# EAGLE design ClockBoard (EAGLE 5.12)

## Sheet 1 of 2
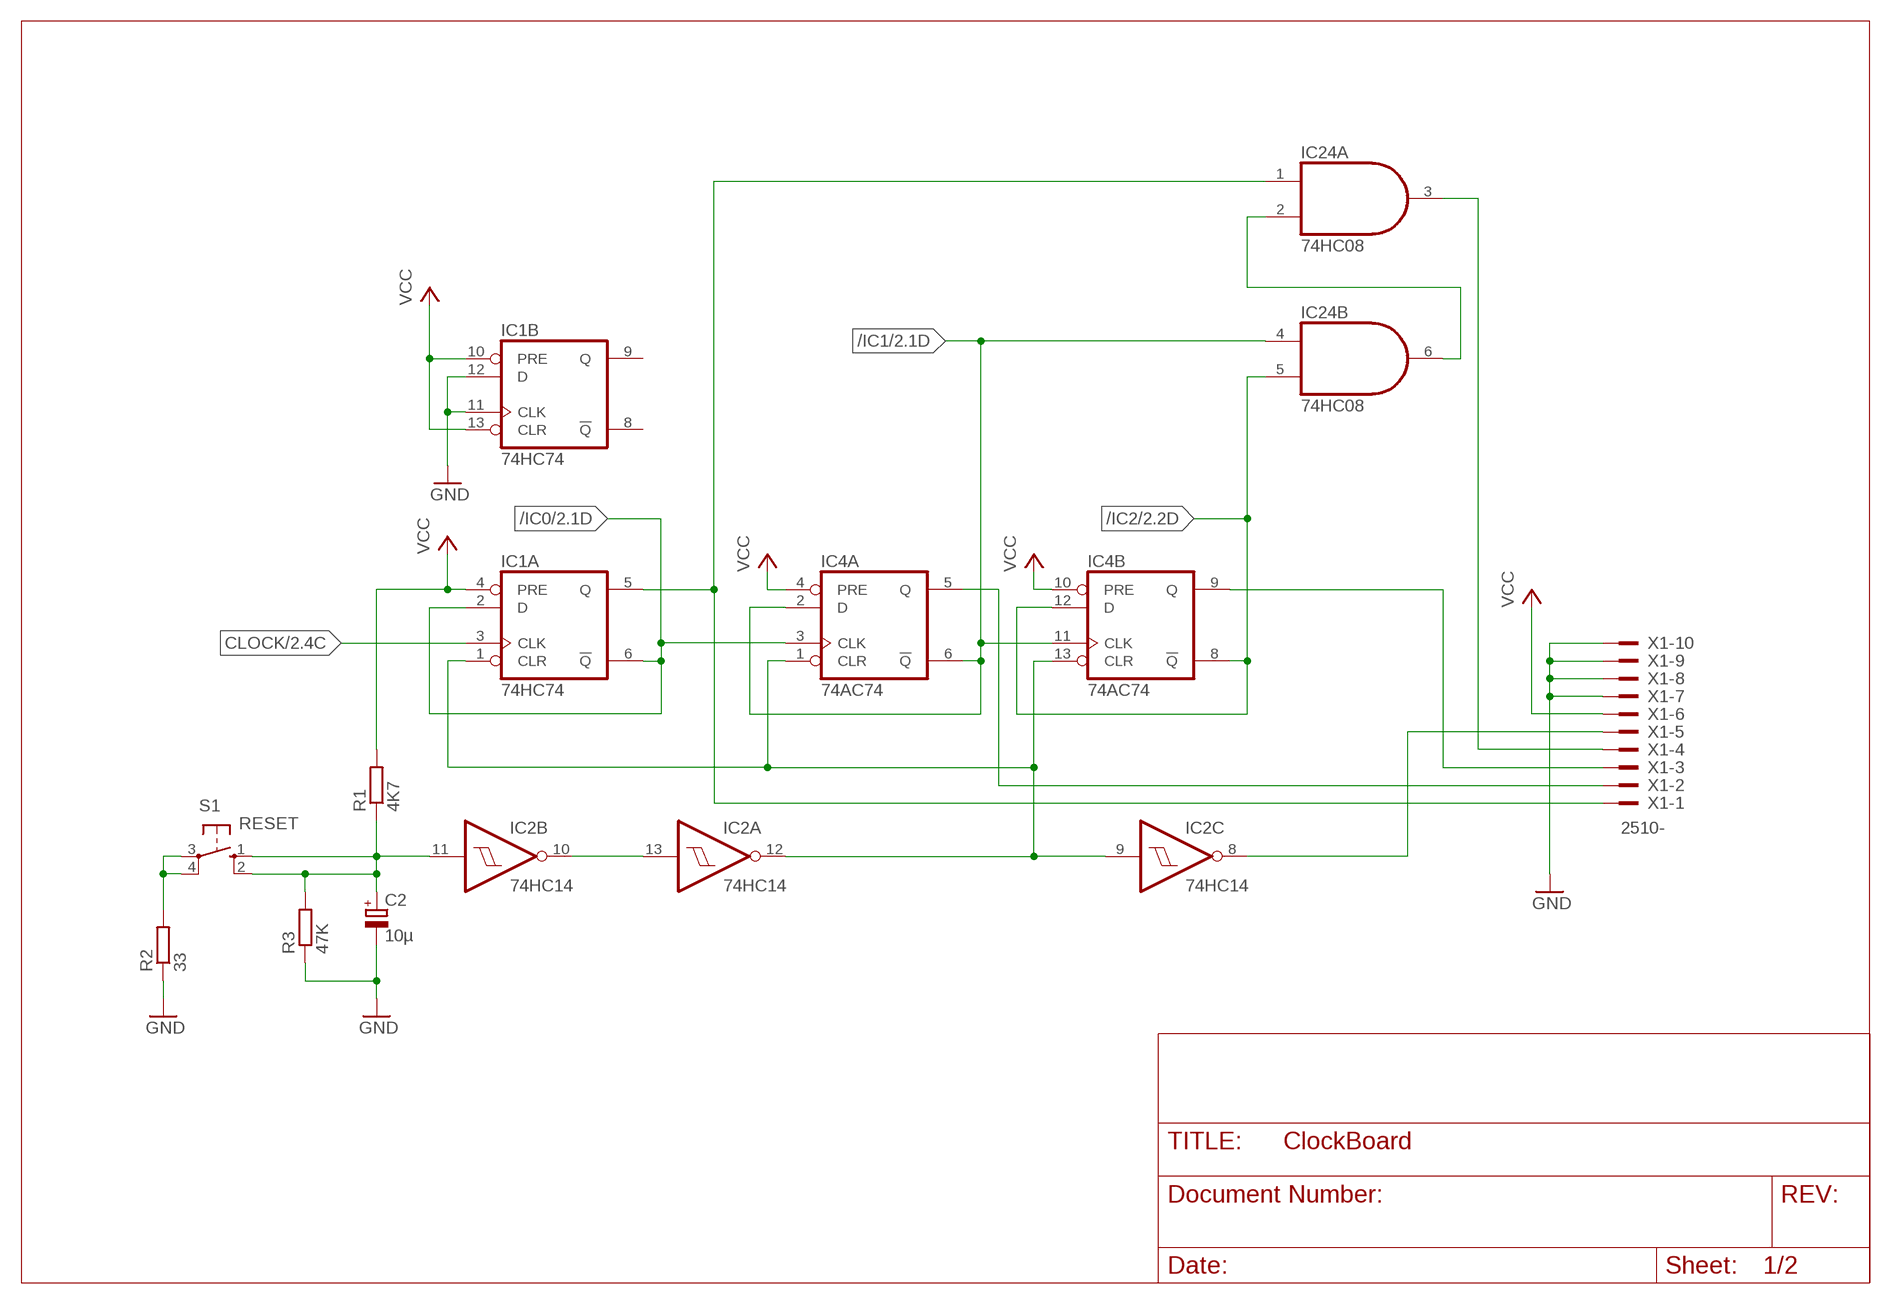
[diagram p0: schematic, sheet 1]

### Parts
C2  10µ  CPOL-EUE2,5-6E  [E2,5-6E]
IC1  74HC74  74LS74N  [DIL14]
IC2  74HC14  74LS14N  [DIL14]
IC4  74AC74  74LS74N  [DIL14]
IC24  74HC08  74LS08N  [DIL14]
R1  4K7  R-EU_0207/10  [0207/10]
R2  33  R-EU_0207/10  [0207/10]
R3  47K  R-EU_0207/10  [0207/10]
S1  RESET  10-XX  [B3F-10XX]
X1  2510-  [PAK100/2500-10]

### Nets
/IC0: IC1.2(A:D) IC1.6(A:!Q) IC4.3(A:CLK) ; also sheet 2
/IC1: IC4.2(A:D) IC4.6(A:!Q) IC4.11(B:CLK) IC24.4(B:I0) ; also sheet 2
/IC2: IC4.8(B:!Q) IC4.12(B:D) IC24.5(B:I1) ; also sheet 2
/RESET: IC1.1(A:CLR) IC2.9(C:I) IC2.12(A:O) IC4.1(A:CLR) IC4.13(B:CLR)
CLOCK: IC1.3(A:CLK) ; also sheet 2
GND: C2.- IC1.11(B:CLK) IC1.12(B:D) R2.1 R3.1 X1.7 X1.8 X1.9 X1.10 ; also sheet 2
IC0: IC1.5(A:Q) IC24.1(A:I0) X1.1
IC1: IC4.5(A:Q) X1.2
IC2: IC4.9(B:Q) X1.3
LOAD_INST: IC24.3(A:O) X1.4
N$3: C2.+ IC2.11(B:I) R1.1 R3.2 S1.1(S) S1.2(S1)
N$4: IC2.10(B:O) IC2.13(A:I)
N$7: R2.2 S1.3(P) S1.4(P1)
N$21: IC24.2(A:I1) IC24.6(B:O)
RESET: IC2.8(C:O) X1.5
VCC: IC1.4(A:PRE) IC1.10(B:PRE) IC1.13(B:CLR) IC4.4(A:PRE) IC4.10(B:PRE) R1.2 X1.6 ; also sheet 2
Unconnected: IC1.8(B:!Q) IC1.9(B:Q)

## Sheet 2 of 2
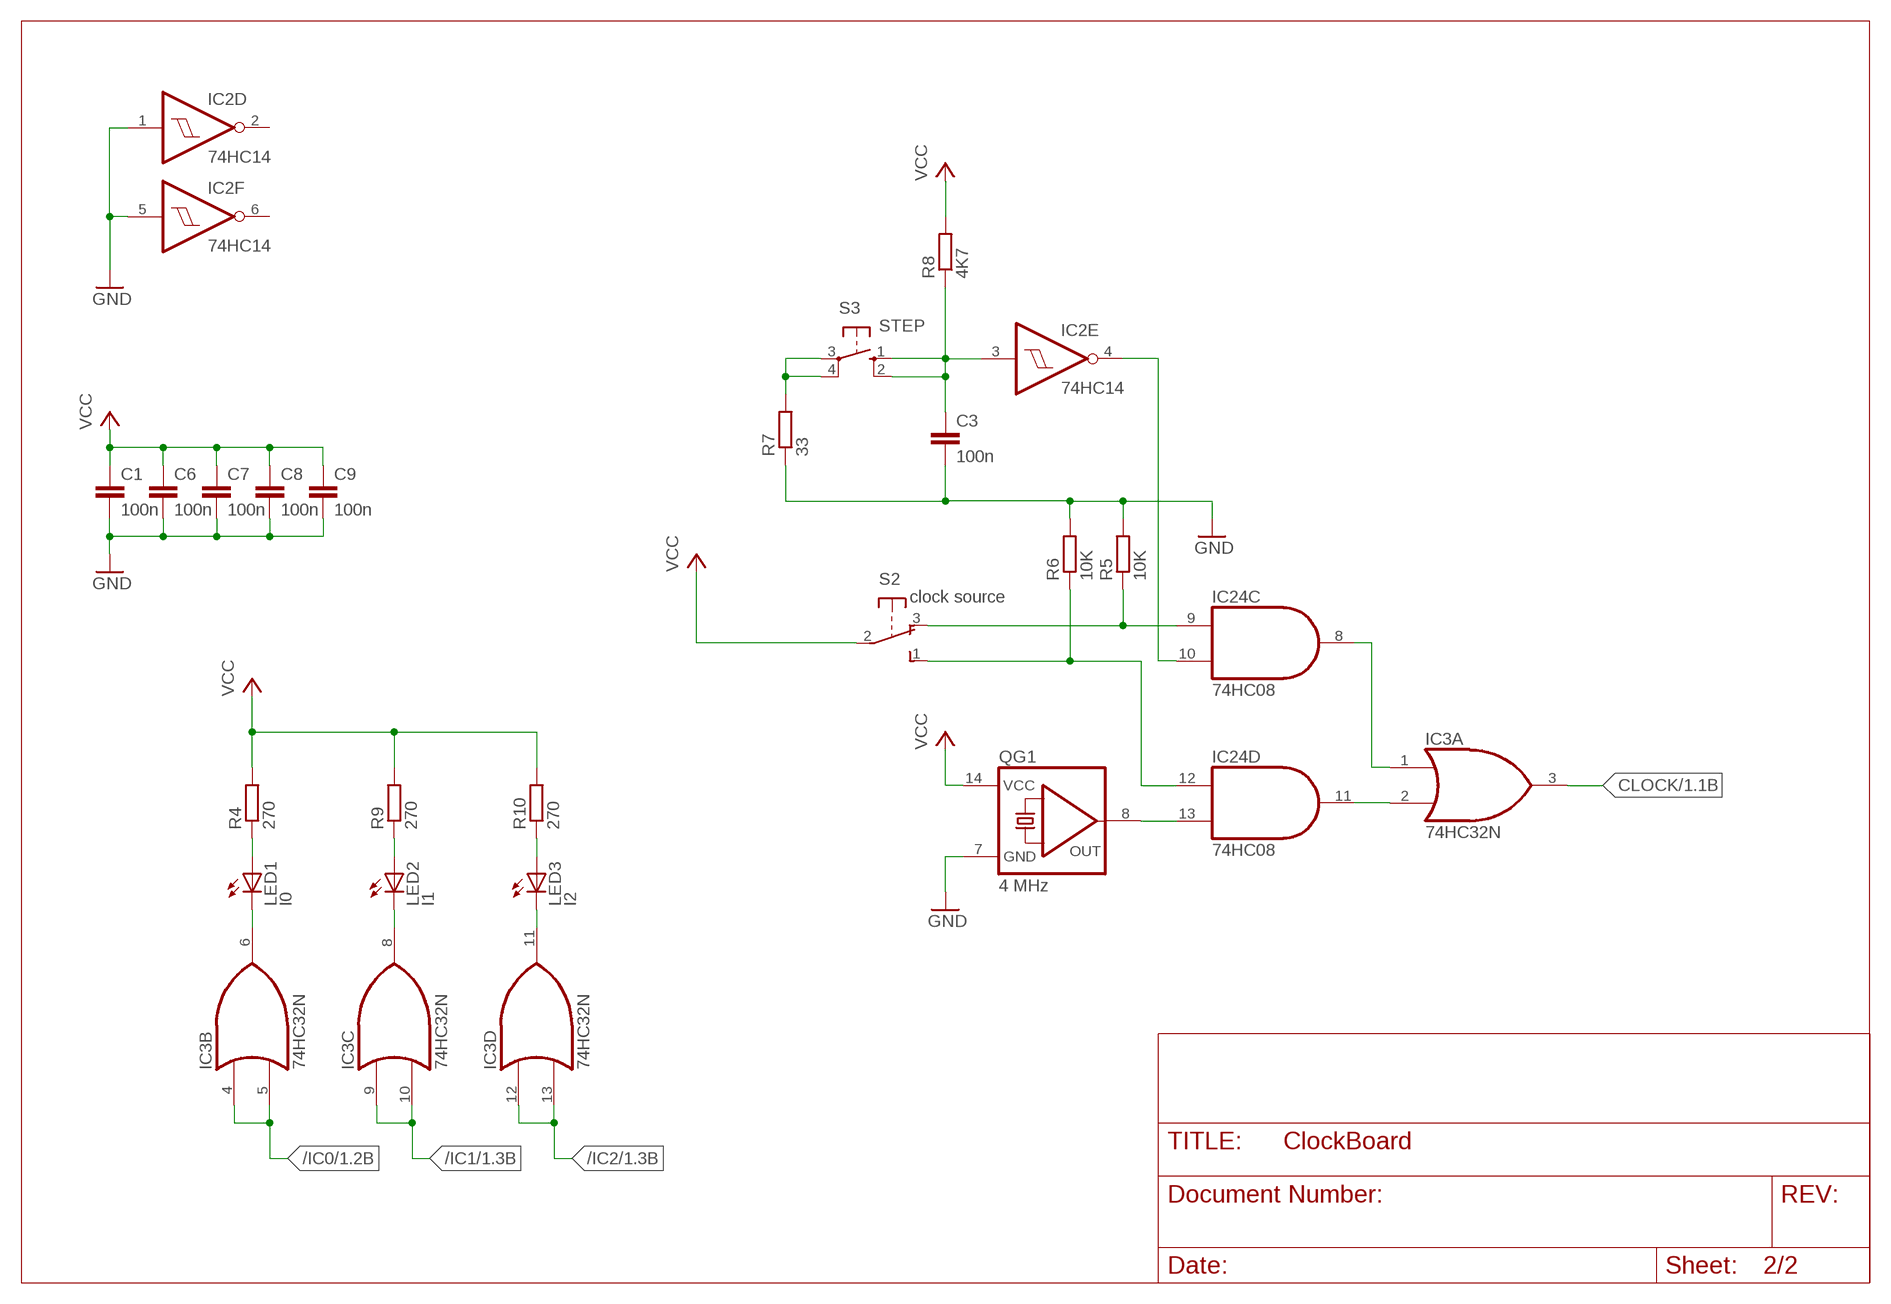
[diagram p1: schematic, sheet 2]

### Parts
C1  100n  C-EU050-025X075  [C050-025X075]
C3  100n  C-EU050-025X075  [C050-025X075]
C6  100n  C-EU050-025X075  [C050-025X075]
C7  100n  C-EU050-025X075  [C050-025X075]
C8  100n  C-EU050-025X075  [C050-025X075]
C9  100n  C-EU050-025X075  [C050-025X075]
IC3  74HC32N  74LS32N  [DIL14]
LED1  I0  LED5MM  [LED5MM]
LED2  I1  LED5MM  [LED5MM]
LED3  I2  LED5MM  [LED5MM]
QG1  4 MHz  QG5860  [DIL14S]
R4  270  R-EU_0207/2V  [0207/2V]
R5  10K  R-EU_0207/10  [0207/10]
R6  10K  R-EU_0207/10  [0207/10]
R7  33  R-EU_0207/10  [0207/10]
R8  4K7  R-EU_0207/10  [0207/10]
R9  270  R-EU_0207/2V  [0207/2V]
R10  270  R-EU_0207/2V  [0207/2V]
S2  clock source  9077-1  [9077-1]
S3  STEP  10-XX  [B3F-10XX]

### Nets
/IC0: IC3.4(B:I0) IC3.5(B:I1) ; also sheet 1
/IC1: IC3.9(C:I0) IC3.10(C:I1) ; also sheet 1
/IC2: IC3.12(D:I0) IC3.13(D:I1) ; also sheet 1
CLOCK: IC3.3(A:O) ; also sheet 1
GND: C1.2 C3.2 C6.2 C7.2 C8.2 C9.2 IC2.1(D:I) IC2.5(F:I) QG1.7(GND) R5.2 R6.2 R7.1 ; also sheet 1
N$2: IC24.13(D:I1) QG1.8(OUT)
N$6: IC3.2(A:I1) IC24.11(D:O)
N$8: IC3.1(A:I0) IC24.8(C:O)
N$13: IC24.12(D:I0) R6.1 S2.1(S)
N$14: IC2.4(E:O) IC24.10(C:I1)
N$15: IC24.9(C:I0) R5.1 S2.3(O)
N$17: C3.1 IC2.3(E:I) R8.1 S3.1(S) S3.2(S1)
N$18: R7.2 S3.3(P) S3.4(P1)
N$22: IC3.6(B:O) LED1.K(C)
N$23: LED1.A R4.1
N$26: IC3.8(C:O) LED2.K(C)
N$27: IC3.11(D:O) LED3.K(C)
N$28: LED2.A R9.1
N$29: LED3.A R10.1
VCC: C1.1 C6.1 C7.1 C8.1 C9.1 QG1.14(VCC) R4.2 R8.2 R9.2 R10.2 S2.2(P) ; also sheet 1
Unconnected: IC2.2(D:O) IC2.6(F:O)

## Power pins joined to a net without a drawn wire
GND: IC1.7(P:GND) IC2.7(P:GND) IC3.7(P:GND) IC4.7(P:GND) IC24.7(P:GND)
VCC: IC1.14(P:VCC) IC2.14(P:VCC) IC3.14(P:VCC) IC4.14(P:VCC) IC24.14(P:VCC)

## Library data of the parts
C1 C3 C6-C9 = rcl:C-EU: CAPACITOR, European symbol
C2 = rcl:CPOL-EU: POLARIZED CAPACITOR, European symbol
IC1 IC4 = 74xx-us:74*74: Dual D type positive edge triggered FLIP FLOP, preset and clear
IC2 = 74xx-us:74*14: Hex schmitt trigger INVERTER
IC3 = 74xx-us:74*32: Quad 2-input OR gate
IC24 = 74xx-us:74*08: Quad 2-input AND gate
LED1-LED3 = led:LED: LED OSRAM: - CHIPLED LG R971, LG N971, LY N971, LG Q971, LY Q971, LO R971, LY R971 LH N974, LH R974 LS Q976, LO Q976, LY Q976 LO Q996 - Hyper CHIPLED LW Q18S LB Q993, LB Q99A, LB R99A - SideLED LS A670, LO A670, LY A670, LG A670, LP A670 LB A673, LV A673, LT A673, LW A673 LH A674 LY A675 LS A676, LA A676, LO A676, LY A676, LW A676 LS A679, LY A679, LG A679 - Hyper Micro SIDELED® LS Y876, LA Y876, LO Y876, LY Y876 LT Y87S - SmartLED LW L88C, LW L88S LB L89C, LB L89S, LG L890 LS L89K, LO L89K, LY L89K LS L896, LA L896, LO L896, LY L896 - TOPLED LS T670, LO T670, LY T670, LG T670, LP T670 LSG T670, LSP T670, LSY T670, LOP T670, LYG T670 LG T671, LOG T671, LSG T671 LB T673, LV T673, LT T673, LW T673 LH T674 LS T676, LA T676, LO T676, LY T676, LB T676, LH T676, LSB T676, LW T676 LB T67C, LV T67C, LT T67C, LS T67K, LO T67K, LY T67K, LW E67C LS E67B, LA E67B, LO E67B, LY E67B, LB E67C, LV E67C, LT E67C LW T67C LS T679, LY T679, LG T679 LS T770, LO T770, LY T770, LG T770, LP T770 LB T773, LV T773, LT T773, LW T773 LH T774 LS E675, LA E675, LY E675, LS T675 LS T776, LA T776, LO T776, LY T776, LB T776 LHGB T686 LT T68C, LB T68C - Hyper Mini TOPLED® LB M676 - Mini TOPLED Santana® LG M470 LS M47K, LO M47K, LY M47K Source: http://www.osram.convergy.de LUXEON: - LUMILED® LXK2-PW12-R00, LXK2-PW12-S00, LXK2-PW14-U00, LXK2-PW14-V00 LXK2-PM12-R00, LXK2-PM12-S00, LXK2-PM14-U00 LXK2-PE12-Q00, LXK2-PE12-R00, LXK2-PE12-S00, LXK2-PE14-T00, LXK2-PE14-U00 LXK2-PB12-K00, LXK2-PB12-L00, LXK2-PB12-M00, LXK2-PB14-N00, LXK2-PB14-P00, LXK2-PB14-Q00 LXK2-PR12-L00, LXK2-PR12-M00, LXK2-PR14-Q00, LXK2-PR14-R00 LXK2-PD12-Q00, LXK2-PD12-R00, LXK2-PD12-S00 LXK2-PH12-R00, LXK2-PH12-S00 LXK2-PL12-P00, LXK2-PL12-Q00, LXK2-PL12-R00 Source: www.luxeon.com KINGBRIGHT: KA-3528ASYC Source: www.kingbright.com
QG1 = crystal:QG5860: CRYSTAL RESONATOR; OC_FARNELL: unknown; OC_NEWARK: unknown
R1-R10 = rcl:R-EU_: RESISTOR, European symbol
S1 S3 = switch-omron:10-XX: OMRON SWITCH; MPN: B3F-1000; OC_FARNELL: 176432; OC_NEWARK: 36M3542
S2 = switch-misc:9077-1: MARQUARDT SWITCH 9077.0100 Distributor: Buerklin <https://www.buerklin.com/default.asp?event=ShowArtikel%2812G2820%29&l=d&jump=ArtNr_12G2820>
X1 = con-3m:2510-: 3M (TM) Pak 100 4-Wall Header Source: 3M; MF: 3M; MPN: 2510-6002UB; OC_FARNELL: 9838244; OC_NEWARK: 46F4725

## Board
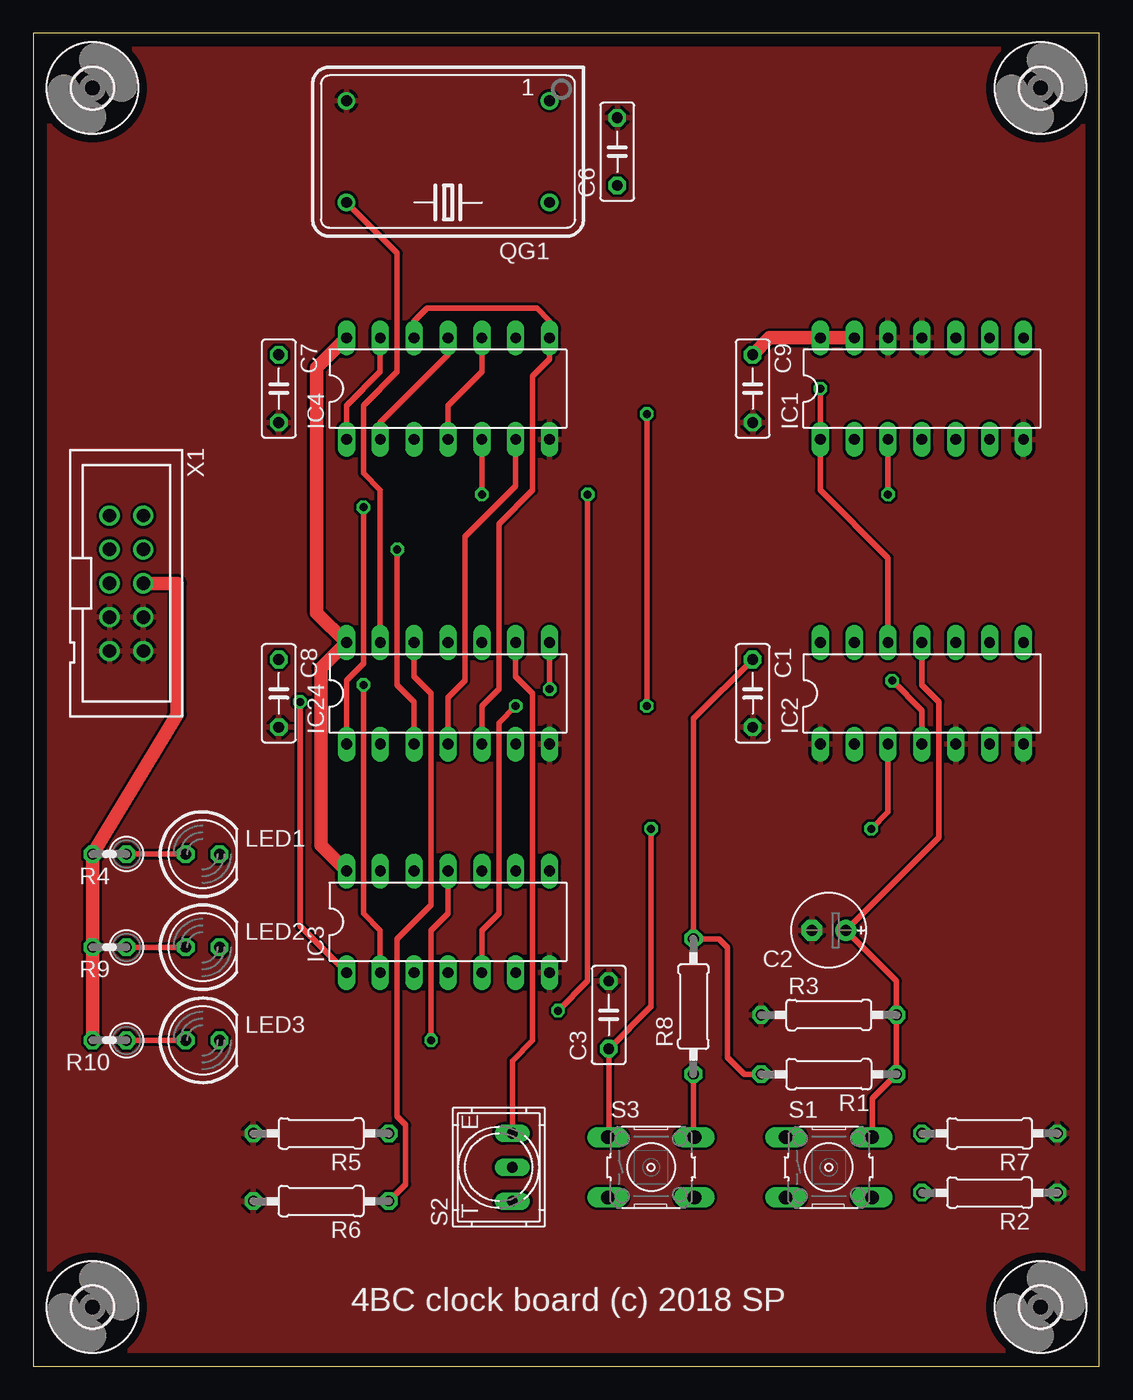
[diagram p2: board, top side]
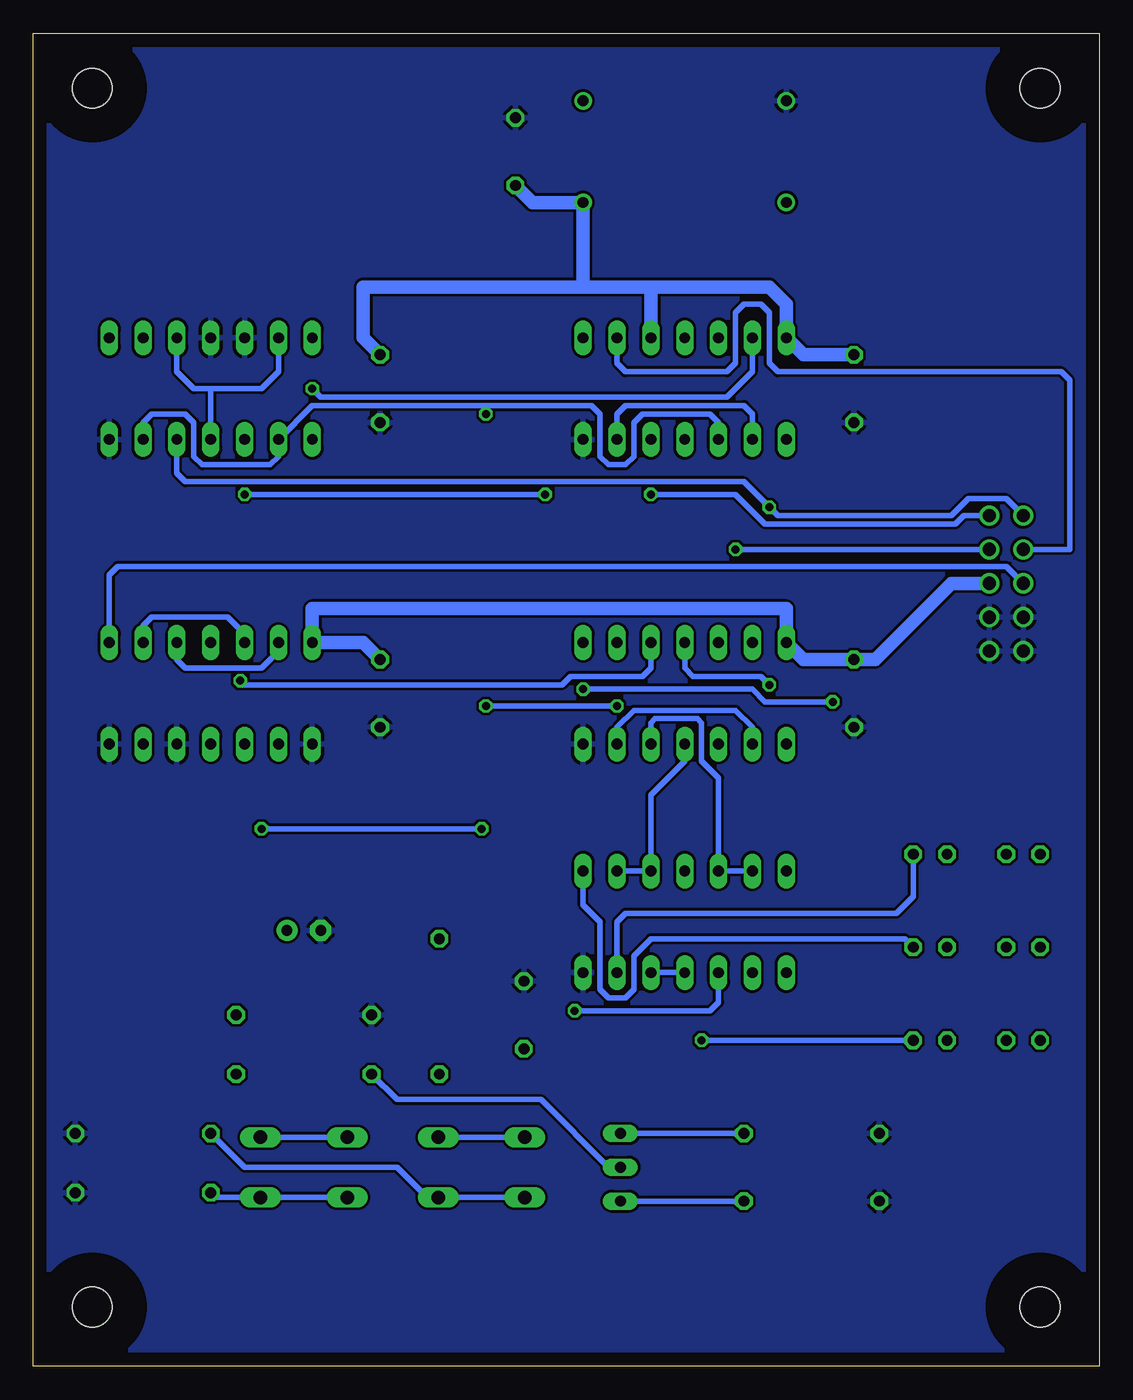
[diagram p3: board, bottom side, seen from below]

Size 79.99 x 100 mm. Coordinates in mm from the lower left corner, seen from the top.
Outline: 0,0 79.99,0 79.99,100 0,100 0,0
Copper layers (1*16): Top 0.035mm / dielectric 1.5mm / Bottom 0.035mm
Design rules "default *": minimum track width 10mil, minimum drill 16mil, track to track 8mil, track to pad 8mil, pad to pad 8mil, via to via 8mil, smd to smd 8mil, copper to edge 40mil, drill to drill 8mil, minimum pad ring 10mil, minimum via ring 8mil, stop-mask expansion 4mil, vias tented up to drill 0mil, thermal gap 10mil

### Footprints (pad centres in the part's own frame; a part is rotated, then mirrored left to right if it is on the bottom)
C050-025X075 = drill 0.813 octagon: 1 -2.54,0; 2 2.54,0
E2,5-6E = drill 0.813 pad 1.575 round: + -1.27,0 | drill 0.813 pad 1.575 octagon: - 1.27,0
DIL14 = drill 0.813 long: 1 -7.62,-3.81; 2 -5.08,-3.81; 3 -2.54,-3.81; 4 0,-3.81; 5 2.54,-3.81; 6 5.08,-3.81; 7 7.62,-3.81; 8 7.62,3.81; 9 5.08,3.81; 10 2.54,3.81; 11 0,3.81; 12 -2.54,3.81; 13 -5.08,3.81; 14 -7.62,3.81
LED5MM = drill 0.813 octagon: A -1.27,0; K 1.27,0
DIL14S = drill 0.813 round: 1 -7.62,-3.81; 7 7.62,-3.81; 8 7.62,3.81; 14 -7.62,3.81
0207/10 = drill 0.813 octagon: 1 -5.08,0; 2 5.08,0
0207/2V = drill 0.813 octagon: 1 -1.27,0; 2 1.27,0
B3F-10XX = drill 1.016 long: 1 -3.251,2.261; 2 3.251,2.261; 3 -3.251,-2.261; 4 3.251,-2.261
9077-1 = drill 0.813 long: 1 -2.54,-1.016; 2 0,-1.016; 3 2.54,-1.016
3,0 = hole 3: 0,0
PAK100/2500-10 = drill 1 pad 1.422 round: 1 -5.08,-1.27; 2 -5.08,1.27; 3 -2.54,-1.27; 4 -2.54,1.27; 5 0,-1.27; 6 0,1.27; 7 2.54,-1.27; 8 2.54,1.27; 9 5.08,-1.27; 10 5.08,1.27

### Placement (x,y rotation side)
C1  53.98,50.48 270 top
C2  59.69,32.7 180 top
C3  43.18,26.35 90 top
C6  43.81,91.12 90 top
C7  18.41,73.34 270 top
C8  18.41,50.48 270 top
C9  53.98,73.34 270 top
IC1  66.67,73.34 0 top
IC2  66.67,50.48 0 top
IC3  31.11,33.34 0 top
IC4  31.11,73.34 0 top
IC24  31.11,50.48 0 top
LED1  12.7,38.42 0 top
LED2  12.7,31.43 0 top
LED3  12.7,24.45 0 top
QG1  31.11,91.12 180 top
R1  59.69,21.91 180 top
R2  71.75,13.02 180 top
R3  59.69,26.35 0 top
R4  5.71,38.42 180 top
R5  21.59,17.46 180 top
R6  21.59,12.38 180 top
R7  71.75,17.46 180 top
R8  49.53,26.99 90 top
R9  5.71,31.43 180 top
R10  5.71,24.45 180 top
S1  59.69,14.92 0 top
S2  34.92,14.92 90 top
S3  46.35,14.92 0 top
U$1  [3,0]  4.45,95.89 0 top
U$2  [3,0]  75.56,95.89 0 top
U$3  [3,0]  75.56,4.45 0 top
U$4  [3,0]  4.45,4.45 0 top
X1  6.99,58.74 270 top

### Tracks (layer width: path | path; a pad name or v marks a point on that pad's centre or on a via)
/IC0  (via drill 0.6)
  Top 0.406: IC3.5 33.66,32.7 34.92,33.97 34.92,48.26 v36.2,49.53 | v46.04,49.53 v46.04,71.44
  Bottom 0.406: 46.04,72.07 38.1,72.07 37.47,71.44 37.47,68.26 36.83,67.63 35.56,67.63 34.92,68.26 34.92,70.8 34.29,71.44 29.21,71.44 28.57,70.8 IC4.3 | 46.04,72.07 59.05,72.07 IC1.2 61.59,68.26 62.23,67.63 67.31,67.63 67.94,68.26 67.94,70.8 68.58,71.44 71.12,71.44 71.75,70.8 IC1.6 | IC3.4 IC3.5 | v36.2,49.53 v46.04,49.53 | v46.04,71.44 46.04,72.07
/IC1
  Top 0.406: IC4.11 31.11,75.88 26.04,70.8 IC4.2 | IC24.4 31.11,50.16 32.38,51.44 32.38,62.23 36.2,66.04 IC4.6
  Bottom 0.406: IC4.6 36.2,71.44 35.56,72.07 26.67,72.07 26.04,71.44 IC4.2 | IC3.9 IC3.10 33.66,42.86 31.11,45.4 IC24.4
/IC2
  Top 0.406: IC4.12 28.57,78.42 29.53,79.38 37.78,79.38 38.73,78.42 IC4.8 38.73,75.56 37.47,74.3 37.47,65.72 34.92,63.18 34.92,50.8 33.66,49.53 IC24.5
  Bottom 0.406: IC3.13 IC3.12 28.57,44.13 29.84,45.4 29.84,48.26 30.16,48.58 33.34,48.58 33.66,48.26 IC24.5
/RESET  (via drill 0.6)
  Top 0.406: IC2.12 64.14,60.64 59.05,65.72 IC1.1 v59.05,73.34 | IC4.1 23.5,72.07 26.04,74.61 IC4.13
  Bottom 0.406: IC2.12 64.14,54.93 65.41,56.2 71.12,56.2 71.75,55.56 IC2.9 | IC4.13 26.04,74.61 27.94,72.71 58.42,72.71 v59.05,73.34
CLOCK  (via drill 0.6)
  Top 0.406: v64.14,65.41 IC1.3 | v41.59,65.41 41.59,28.89 v39.37,26.67
  Bottom 0.406: v41.59,65.41 v64.14,65.41 | v39.37,26.67 29.21,26.67 28.57,27.3 IC3.3
GND
  pour Bottom: 0,100.33 79.69,100.33 79.69,0 0,0
  pour Top: 0,100.33 80.01,100.33 80.01,0 0,0
IC0  (via drill 0.6)
  Top 0.406: v24.77,64.45 24.77,52.7 23.5,51.44 IC24.1
  Bottom 0.406: IC1.5 69.22,66.99 68.58,66.36 26.67,66.36 v24.77,64.45 24.13,63.82 11.11,63.82 9.84,65.09 6.99,65.09 X1.1
IC1  (via drill 0.6)
  Top 0.406: v33.66,65.41 IC4.5
  Bottom 0.406: v33.66,65.41 27.3,65.41 25.08,63.18 10.79,63.18 10.16,63.82 X1.2
IC2
  Bottom 0.406: IC4.9 36.2,75.25 35.56,74.61 27.94,74.61 27.3,75.25 27.3,79.06 26.67,79.69 25.4,79.69 24.77,79.06 24.77,75.25 24.13,74.61 2.86,74.61 2.22,73.98 2.22,61.28 X1.3
LOAD_INST  (via drill 0.6)
  Top 0.406: v27.3,61.28 27.3,51.12 28.57,49.85 IC24.3
  Bottom 0.406: X1.4 v27.3,61.28
N$2
  Top 0.406: IC24.13 26.04,65.72 24.77,66.99 24.77,72.07 27.3,74.61 27.3,83.5 QG1.8
N$3
  Top 0.406: S1.2 62.94,20.08 R1.1 R3.2 64.77,28.89 C2.+ 67.94,39.69 67.94,49.85 66.67,51.12 IC2.11
  Bottom 0.406: S1.1 S1.2
N$4
  Bottom 0.406: IC2.13 61.59,53.66 62.87,52.39 68.58,52.39 69.22,53.02 IC2.10
N$6  (via drill 0.6)
  Top 0.406: v24.77,51.12 24.77,33.97 26.04,32.7 IC3.2
  Bottom 0.406: IC24.11 31.11,52.39 30.48,51.75 25.4,51.75 v24.77,51.12
N$7
  Bottom 0.406: S1.3 S1.4 66.32,12.66 R2.2
N$8  (via drill 0.6)
  Top 0.406: v38.73,50.8 IC24.8 | v20,49.85 20,33.02 IC3.1
  Bottom 0.406: v38.73,50.8 26.04,50.8 25.08,49.85 v20,49.85
N$13
  Top 0.406: IC24.12 28.57,51.75 29.84,50.48 29.84,34.61 27.3,32.07 27.3,18.73 27.94,18.1 27.94,13.65 R6.1
  Bottom 0.406: R6.1 S2.1
N$14  (via drill 0.6)
  Top 0.406: IC2.4 66.67,49.21 v64.45,51.44
  Bottom 0.406: v64.45,51.44 64.14,51.12 40.32,51.12 39.69,51.75 34.29,51.75 33.66,52.39 IC24.10
N$15
  Top 0.406: S2.3 35.94,22.92 37.47,24.45 37.47,50.48 36.2,51.75 IC24.9
  Bottom 0.406: R5.1 S2.3
N$17  (via drill 0.6)
  Top 0.406: S3.1 43.18,17.26 C3.1 46.35,26.99 v46.35,40.32 | R8.1 49.53,17.26 S3.2 | IC2.3 64.14,41.59 v62.87,40.32
  Bottom 0.406: S3.1 S3.2 | v46.35,40.32 v62.87,40.32
N$18
  Bottom 0.406: S3.3 S3.4 50.44,12.66 52.7,14.92 64.14,14.92 R7.2
N$21
  Bottom 0.406: IC24.2 26.04,47.94 27.3,49.21 34.92,49.21 36.2,47.94 IC24.6
N$22
  Bottom 0.406: IC3.6 36.2,33.34 35.56,33.97 15.24,33.97 13.97,35.24 LED1.K
N$23
  Top 0.406: R4.1 LED1.A
N$26
  Bottom 0.406: LED2.K 14.61,32.07 33.66,32.07 34.92,30.8 34.92,28.26 35.56,27.62 36.83,27.62 37.47,28.26 37.47,33.34 38.73,34.61 IC3.8
N$27  (via drill 0.6)
  Top 0.406: v29.84,24.45 29.84,32.7 31.11,33.97 IC3.11
  Bottom 0.406: LED3.K v29.84,24.45
N$28
  Top 0.406: R9.1 LED2.A
N$29
  Top 0.406: R10.1 LED3.A
RESET
  Bottom 0.406: IC2.8 74.3,59.37 73.66,60.01 6.99,60.01 X1.5
VCC
  Top 0.406: IC4.4 31.11,72.07 33.66,74.61 IC4.10 | C1.1 49.53,48.58 R8.2 51.44,32.07 52.07,31.43 52.07,23.18 53.34,21.91 R1.2
  Top 1.016: IC4.14 21.27,74.93 21.27,56.52 IC24.14 21.59,52.39 21.59,39.05 IC3.14 | IC1.13 IC1.14 55.24,77.15 C9.1 | R10.2 R9.2 R4.2 10.79,48.9 10.79,58.74 X1.6
  Bottom 0.406: IC1.13 61.59,74.61 62.87,73.34 66.67,73.34 | 66.67,73.34 67.94,73.34 69.22,74.61 IC1.10 | 66.67,73.34 IC1.4 | R1.2 52.7,20 41.91,20 36.83,14.92 S2.2
  Bottom 1.016: C7.1 22.23,75.88 IC4.14 23.5,79.69 24.77,80.96 33.66,80.96 | C9.1 55.24,77.15 55.24,80.96 38.42,80.96 | 33.66,80.96 38.42,80.96 | 33.66,80.96 IC4.10 | C1.1 55.24,54.29 IC2.14 59.05,56.83 23.5,56.83 IC24.14 22.23,53.02 C8.1 16.83,53.02 11.11,58.74 X1.6 | 38.42,80.96 38.73,81.28 QG1.14 42.55,87.31 C6.1

### Text on the board
tNames: 4BC clock board (c) 2018 SP